# EasyEDA Pro project flight controller.epro

# Schematic Schematic1
Board Name: Board1; Create Date: 2026-03-05; Page Name: P1; Project Name: flight controller; Schematic Name: Schematic1; Update Date: 2026-03-16; Company: EasyEDA.com; Page Size: A4; Version: V1.0
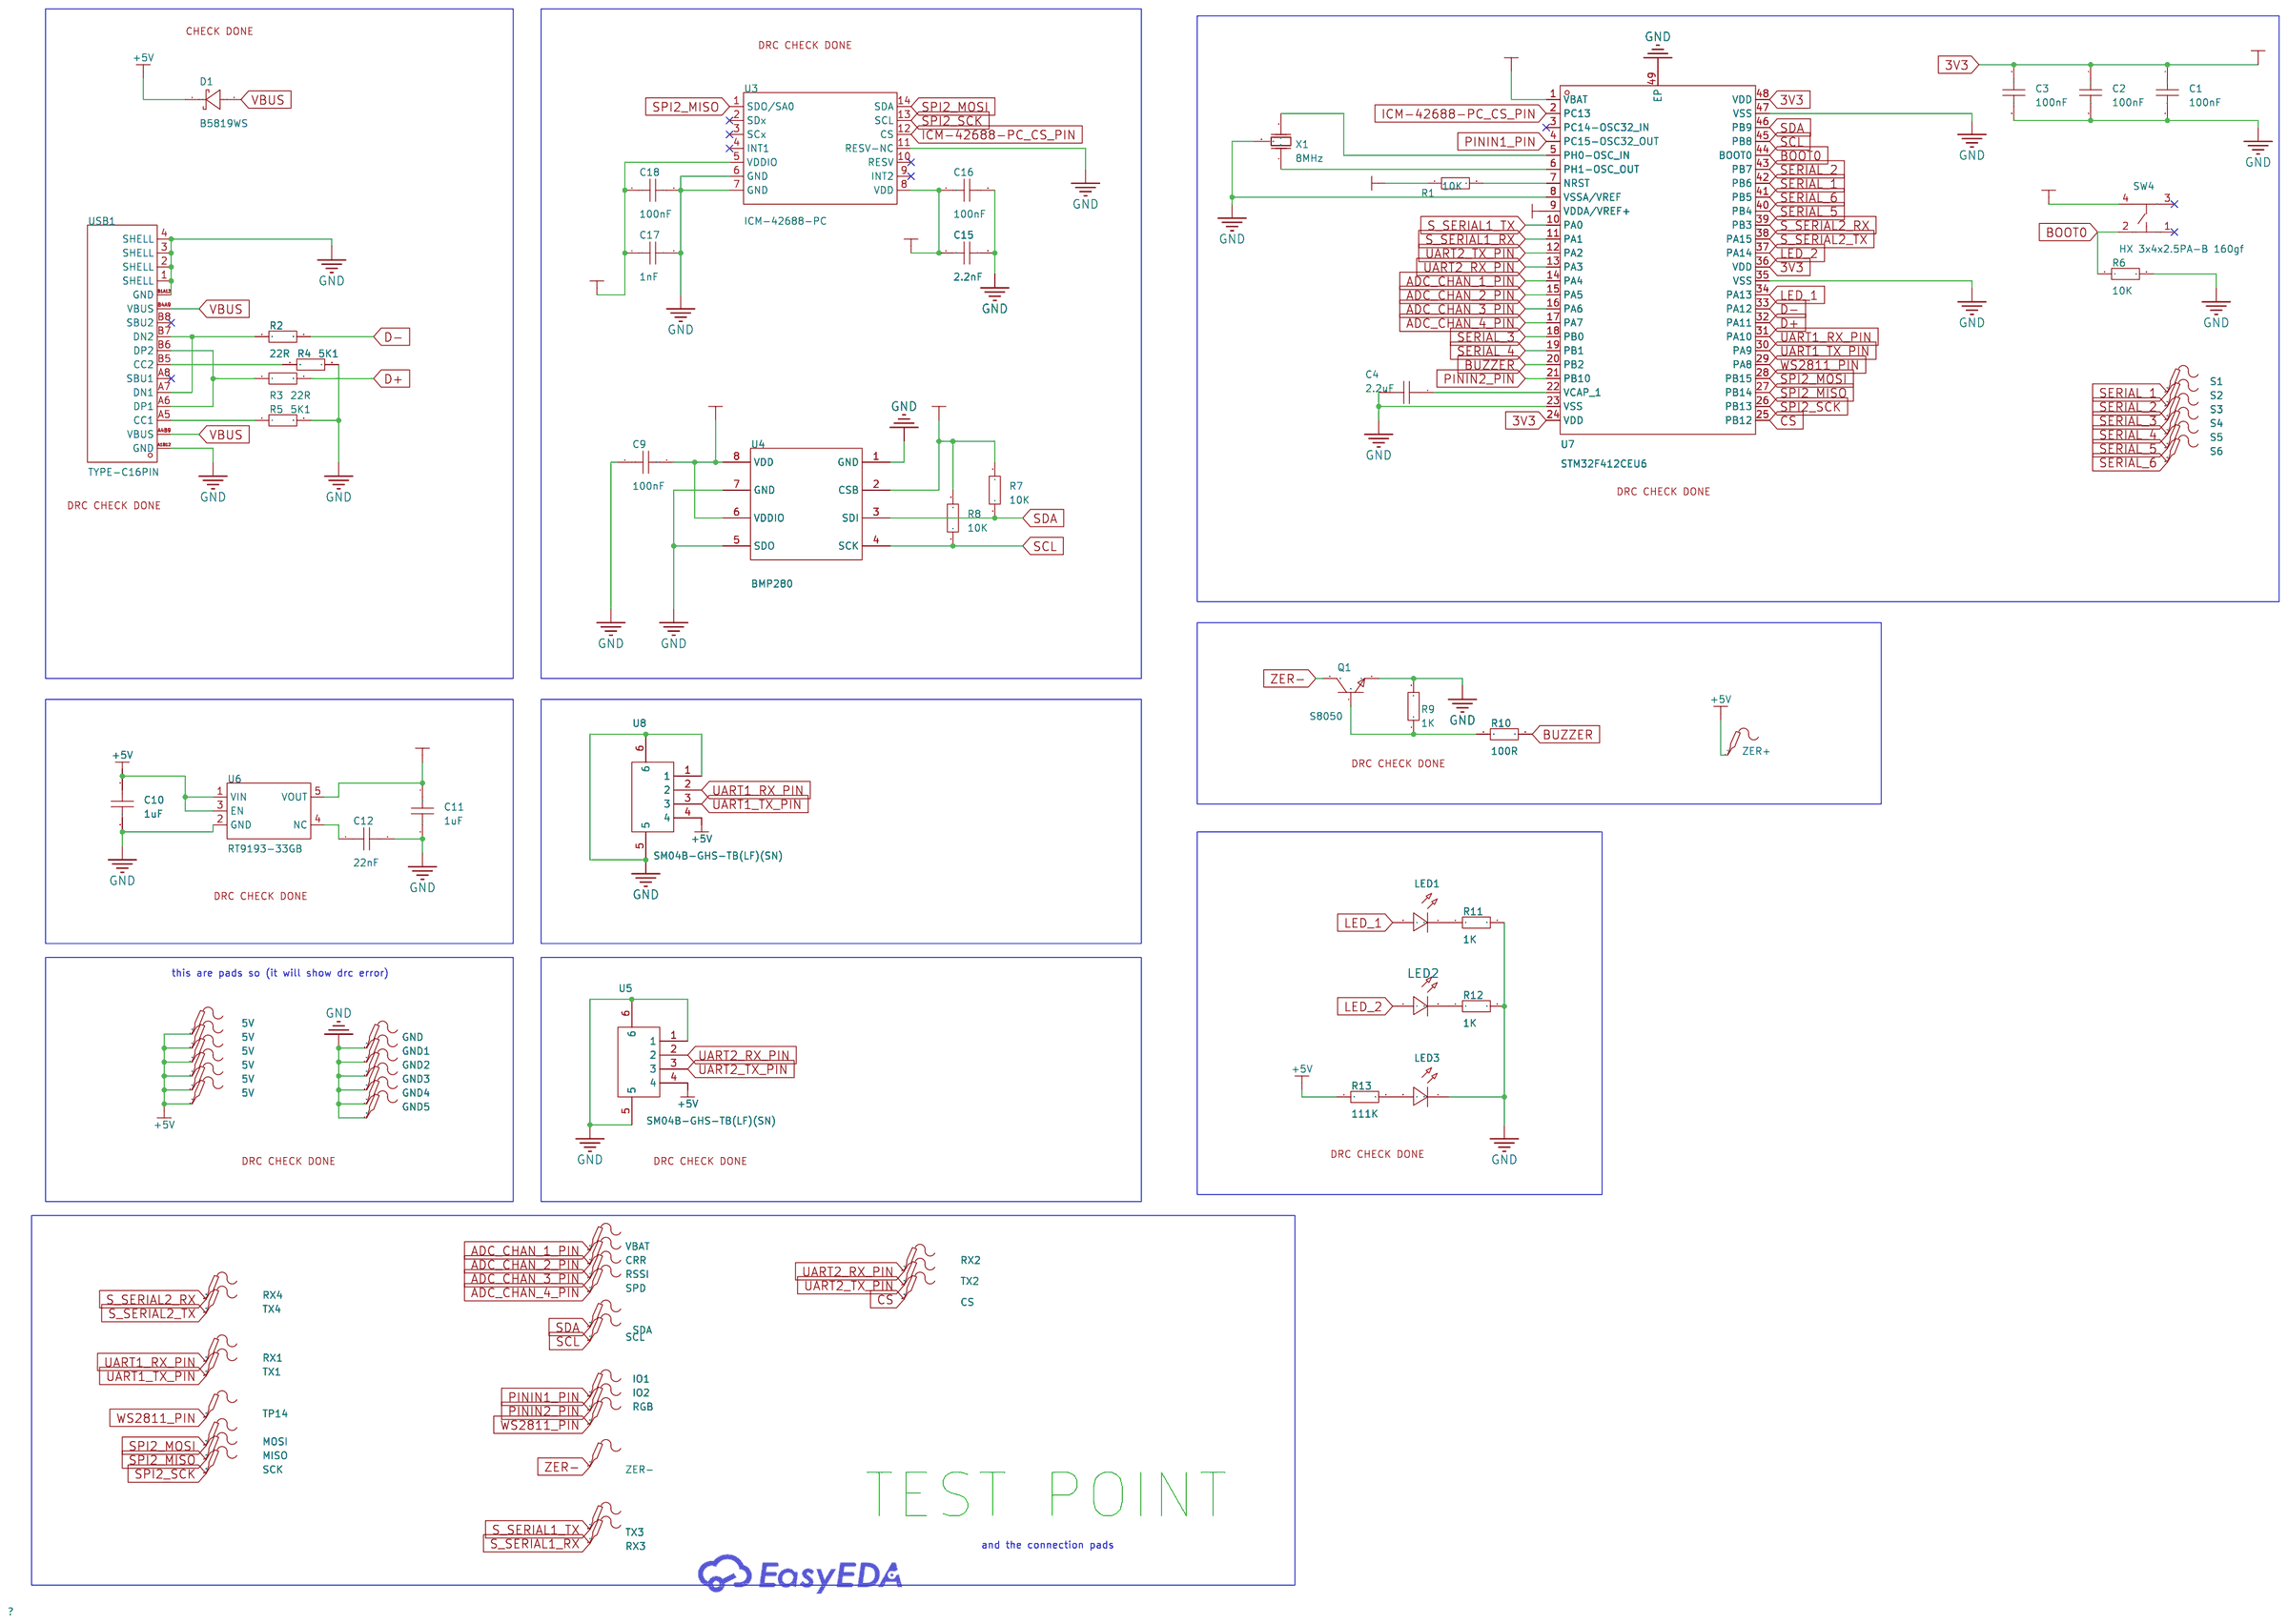
[diagram p0: schematic sheet]

## Parts
5V  -  [Test-Point-0.5mm]
5V#2  -  [Test-Point-0.5mm]
5V#3  -  [Test-Point-0.5mm]
5V#4  -  [Test-Point-0.5mm]
5V#5  -  [Test-Point-0.5mm]
5V#6  -  [Test-Point-0.5mm]
C1  100nF  [C0603]
C2  100nF  [C0603]
C3  100nF  [C0603]
C4  2.2uF  [C0603]
C9  100nF  [C0603]
C10  1uF  [C0603]
C11  1uF  [C0603]
C12  22nF  [C0603]
C15  2.2nF  [C0603]
C16  100nF  [C0603]
C17  1nF  [C0603]
C18  100nF  [C0603]
CRR  -  [Test-Point-0.5mm]
CS  -  [Test-Point-0.5mm]
D1  B5819WS  [SOD-323_L1.7-W1.3-LS2.5-RD]
GND  -  [Test-Point-0.5mm]
GND1  -  [Test-Point-0.5mm]
GND2  -  [Test-Point-0.5mm]
GND3  -  [Test-Point-0.5mm]
GND4  -  [Test-Point-0.5mm]
GND5  -  [Test-Point-0.5mm]
IO1  -  [Test-Point-0.5mm]
IO2  -  [Test-Point-0.5mm]
LED1  -  [LED0603-RD_GREEN]
LED2  -  [LED0603-R-RD]
LED3  -  [LED0603-RD_GREEN]
MISO  -  [Test-Point-0.5mm]
MOSI  -  [Test-Point-0.5mm]
Q1  S8050  [SOT-23-3_L2.9-W1.6-P1.90-LS2.8-BR]
R1  10K  [R0603]
R2  22R  [R0603]
R3  22R  [R0603]
R4  5K1  [R0603]
R5  5K1  [R0603]
R6  10K  [R0603]
R7  10K  [R0603]
R8  10K  [R0603]
R9  1K  [R0603]
R10  100R  [R0603]
R11  1K  [R0603]
R12  1K  [R0603]
R13  111K  [R0603]
RGB  -  [Test-Point-0.5mm]
RSSI  -  [Test-Point-0.5mm]
RX1  -  [Test-Point-0.5mm]
RX2  -  [Test-Point-0.5mm]
RX3  -  [Test-Point-0.5mm]
RX4  -  [Test-Point-0.5mm]
S1  -  [Test-Point-0.5mm]
S2  -  [Test-Point-0.5mm]
S3  -  [Test-Point-0.5mm]
S4  -  [Test-Point-0.5mm]
S5  -  [Test-Point-0.5mm]
S6  -  [Test-Point-0.5mm]
SCK  -  [Test-Point-0.5mm]
SCL  -  [Test-Point-0.5mm]
SDA  -  [Test-Point-0.5mm]
SPD  -  [Test-Point-0.5mm]
SW4  HX 3x4x2.5PA-B 160gf  [SW-SMD_4P-L4.2-W3.4-P2.15-LS5.2]
TP14  -  [Test-Point-0.5mm]
TX1  -  [Test-Point-0.5mm]
TX2  -  [Test-Point-0.5mm]
TX3  -  [Test-Point-0.5mm]
TX4  -  [Test-Point-0.5mm]
U3  ICM-42688-PC  [LGA-14_L3.0-W2.5-P0.50-TL]
U4  BMP280  [LGA-8_L2.5-W2.0-P0.65_AMP6127]
U5  SM04B-GHS-TB(LF)(SN)  [CONN-SMD_4P-P1.25_SM04B-GHS-TB-LF-SN]
U6  RT9193-33GB  [SOT-23-5_L3.0-W1.5-P0.95-LS2.8-BL]
U7  STM32F412CEU6  [UFQFPN-48_L7.0-W7.0-P0.50-BL-EP5.6]
U8  SM04B-GHS-TB(LF)(SN)  [CONN-SMD_4P-P1.25_SM04B-GHS-TB-LF-SN]
USB1  TYPE-C16PIN  [USB-C-SMD_TYPE-C16PIN]
VBAT  -  [Test-Point-0.5mm]
X1  8MHz  [OSC-SMD_3P-L3.2-W1.3-P1.20-L]
ZER+  -  [Test-Point-0.5mm]
ZER-  -  [Test-Point-0.5mm]

## Library data of the parts
5V 5V#2-5V#6 CRR CS GND GND1-GND5 IO1 IO2 MISO MOSI RGB RSSI RX1-RX4 S1-S6 SCK SCL SDA SPD TP14 TX1-TX4 VBAT ZER+ ZER- = Test-Point: Test Point 测试点
C1-C4 C9-C12 C15-C18 = CAP_0603: Supplier Footprint: 0603
D1 = B5819WS_C22368873: Voltage - Forward(Vf@If):900mV@3A Voltage - DC Reverse(Vr):40V Current - Rectified:1A Reverse Leakage Current (Ir):1mA@40V Operating Junction Temperature Range:-55℃~+150℃ Operating Junction Temperature Range:-55℃~+150℃ Non-Repetitive Peak Forward Surge Cu; LCSC Part Name: 电压:40V 电流:1A; Supplier Part: C22368873; Manufacturer: Wild Goose(威谷); Supplier Footprint: SOD-323; JLCPCB Part Class: Extended Part; Datasheet: https://item.szlcsc.com/datasheet/B5819WS/23847185.html; Supplier: LCSC; Voltage - Forward(Vf@If): 900mV@3A; Voltage - DC Reverse(Vr): 40V; Current - Rectified: 1A; Reverse Leakage Current (Ir): 1mA@40V; Operating Junction Temperature Range: -55℃~+150℃; Non-Repetitive Peak Forward Surge Current: 25A
LED1 LED3 = LED_0603-G
LED2 = LED_0603-R: Supplier Footprint: 0603
Q1 = S8050_C7603172: type:NPN Current - Collector(Ic):500mA Collector - Emitter Voltage VCEO:25V Pd - Power Dissipation:300mW DC Current Gain:80@50mA,1V DC Current Gain:80@50mA,1V Transition frequency(fT):- Current - Collector Cutoff:1uA Vce Saturation(VCE(sat)):500mV Operati; LCSC Part Name: NPN 电流:500mA 电压:25V; Supplier Part: C7603172; Manufacturer: KUU; Supplier Footprint: SOT-23; JLCPCB Part Class: Extended Part; Datasheet: https://item.szlcsc.com/datasheet/S8050/8728666.html; Supplier: LCSC; type: NPN; Current - Collector(Ic): 500mA; Collector - Emitter Voltage VCEO: 25V; Pd - Power Dissipation: 300mW; DC Current Gain: 80@50mA,1V; Current - Collector Cutoff: 1uA; Vce Saturation(VCE(sat)): 500mV; Emitter-Base Voltage(Vebo): 5V
R1-R13 = Res_0603: Supplier Footprint: 0603
SW4 = HX 3x4x2.5PA-B 160gf: LCSC Part Name: 3*4*2.5mm 四脚贴片硅胶蓝钮; Supplier Part: C41427503; Manufacturer: hanxia(韩下); Supplier Footprint: SMD-4P,4.2x3.35mm; Datasheet: https://atta.szlcsc.com/upload/public/pdf/source/20241011/97E264A19DD25A542C006A9917ED0D99.pdf; Supplier: LCSC
U3 = ICM-42688-PC: Accelerometer Sensing Axis:X,Y,Z Acceleration Measurement Range (MAX):±16g Acceleration Measurement Range (MAX):±16g Gyroscope Sensing Axis:X,Y,Z Gyroscope Measurement Range (MAX):±2048dps Gyroscope Measurement Range (MAX):±2048dps Sensor Type:IMU Output; LCSC Part Name: 低噪声、宽带宽6D惯性测量单元，带运动协处理器; Supplier Part: C48586483; Manufacturer: Tokmas(托克马斯); Supplier Footprint: LGA-14(2.5x3); JLCPCB Part Class: Extended Part; Datasheet: https://item.szlcsc.com/datasheet/ICM-42688-PC/50854565.html; Supplier: LCSC; Accelerometer Sensing Axis: X,Y,Z; Acceleration Measurement Range (MAX): ±16g; Gyroscope Sensing Axis: X,Y,Z; Gyroscope Measurement Range (MAX): ±2048dps; Sensor Type: IMU; Output Bits: 16bit; Interface: I3C；I2C；SPI; Voltage - Supply: 1.71V~3.6V; Cache Size: 1.5KB; Operating Temperature: -40℃~+85℃
U4 = BMP280: LCSC Part Name: BMP280 停产; Supplier Part: C83291; Manufacturer: Bosch(博世); Supplier Footprint: LGA-8(2x2.5); JLCPCB Part Class: Extended Part; Datasheet: https://atta.szlcsc.com/upload/public/pdf/source/20200702/C83291_F39E84AB7DFC569A4C7554F8659640A1.pdf; Supplier: LCSC
U5 U8 = SM04B-GHS-TB(LF)(SN): Pins Structure:1x4P Pitch:1.25mm Mounting Type:Surface Mount, Right Angle Reference Series:GH Number of Pins:4P Number of Rows:1 Number of PINs Per Row:4 Row Spacing:- Current Rating:1A Contact Material:Phosphor Bronze Contact Plating:Tin Operating Temper; LCSC Part Name: 1x4P 间距:1.25mm 卧贴 系列:GH; Supplier Part: C189895; Manufacturer: JST; Supplier Footprint: SMD,P=1.25mm,卧贴; JLCPCB Part Class: Extended Part; Datasheet: https://item.szlcsc.com/datasheet/SM04B-GHS-TB(LF)(SN)/207060.html; Supplier: LCSC; Pins Structure: 1x4P; Pitch: 1.25mm; Mounting Type: Surface Mount, Right Angle; Reference Series: GH; Number of Pins: 4P; Number of Rows: 1; Number of PINs Per Row: 4; Current Rating: 1A; Contact Material: Phosphor Bronze; Contact Plating: Tin; Operating Temperature: -25℃~+85℃; Voltage Rating: 50V; Plastic Material: PA9T; Flame Retardant Rating: UL94V-0; Supplementary Features: Auxiliary Solder Pin; Color: White; Z-Height of the Board: 4.25mm; X-Length of Bottom Edge on Board (Spacing Line): 8.25mm; Y-Width of Bottom Edge on Board: 4.13mm
U6 = RT9193-33GB_C19268156: Output Type:Fixed Voltage - Supply:6V Output Voltage:3.3V Output Voltage:3.3V Output Current:300mA Power Supply Rejection Ratio (PSRR):70dB@(1KHz) standby current:70uA Noise:50uVrms Features:Enable Operating Temperature:-25℃~+85℃@(Ta) Operating Temperatur; LCSC Part Name: 3.3V 300mA 6V; Supplier Part: C19268156; Manufacturer: TECH PUBLIC(台舟); Supplier Footprint: SOT-23-5; JLCPCB Part Class: Extended Part; Datasheet: https://item.szlcsc.com/datasheet/RT9193-33GB/20526334.html; Supplier: LCSC; Output Type: Fixed; Voltage - Supply: 6V; Output Voltage: 3.3V; Output Current: 300mA; Power Supply Rejection Ratio (PSRR): 70dB@(1KHz); standby current: 70uA; Noise: 50uVrms; Features: Enable; Operating Temperature: -25℃~+85℃@(Ta); Output Configuration: Positive; Number of Outputs: 1
U7 = STM32F412CEU6: CPU Core:ARM-M4 CPU Maximum Speed:100MHz Program Storage Size:512KB Program Memory Type:FLASH Number of I/O:36 ADC (Bit):12bit Voltage - Supply:1.7V~3.6V Voltage - Supply:1.7V~3.6V Applications:-; LCSC Part Name: 支持BAM的STM32动态效率MCU，带DSP和FPU的高性能ARM Cortex-M4 MCU，具有512 KB Flash、100 MHz CPU、ART加速器和DFSDM; Supplier Part: C1337664; Manufacturer: ST(意法半导体); Supplier Footprint: UFQFPN-48(7x7); JLCPCB Part Class: Extended Part; Datasheet: https://item.szlcsc.com/datasheet/STM32F412CEU6/1427944.html; Supplier: LCSC; CPU Core: ARM-M4; CPU Maximum Speed: 100MHz; Program Storage Size: 512KB; Program Memory Type: FLASH; Number of I/O: 36; ADC (Bit): 12bit; Voltage - Supply: 1.7V~3.6V
USB1 = TYPE-C16PIN: Connector Type:Type-C Protocol Standard:- Gender:Female Mounting Type:Surface Mount, Right Angle Number of Contacts:16P Number of Ports:1 Current Rating-Power:3A Voltage Rating:30V Connect-Disconnect Life:10,000 Cycles Supplementary Features:- Center Heig; LCSC Part Name: 16P卧贴母座; Supplier Part: C393939; Manufacturer: SHOU HAN(首韩); Supplier Footprint: SMD; JLCPCB Part Class: Extended Part; Datasheet: https://item.szlcsc.com/datasheet/TYPE-C16PIN/372551.html; Supplier: LCSC; Connector Type: Type-C; Gender: Female; Mounting Type: Surface Mount, Right Angle; Number of Contacts: 16P; Number of Ports: 1; Current Rating-Power: 3A; Voltage Rating: 30V; Connect-Disconnect Life: 10,000 Cycles; Detection color: Black; Operating Temperature: -40℃~+85℃
X1 = CSTNE8M00GH5C000R0: Frequency:8MHz Built - in Load Capacitance:33pF Resonant Impedance:40Ω Operating Temperature:-40℃~+125℃ Operating Temperature:-40℃~+125℃; LCSC Part Name: 8MHz ±0.07% 内置负载电容:33pF; Supplier Part: C341525; Manufacturer: muRata(村田); Supplier Footprint: SMD3213-3P; JLCPCB Part Class: Extended Part; Datasheet: https://item.szlcsc.com/datasheet/CSTNE8M00GH5C000R0/318917.html; Supplier: LCSC; Built - in Load Capacitance: 33pF; Resonant Impedance: 40Ω; Operating Temperature: -40℃~+125℃

## Nets
3V3: C1.1 C2.1 C3.1 C9.1 C11.1 C15.1 C16.1 C17.1 C18.1 R1.1 R7.2 R8.2 SW4.4 U3.5(VDDIO) U3.8(VDD) U4.2(CSB) U4.6(VDDIO) U4.8(VDD) U6.5(VOUT) U7.1(VBAT) U7.9(VDDA/VREF+) U7.24(VDD) U7.36(VDD) U7.48(VDD)
+5V: 5V.1 5V#2.1 5V#3.1 5V#4.1 5V#5.1 5V#6.1 C10.1 D1.1(C) R13.1 U5.4 U6.1(VIN) U6.3(EN) U8.4 ZER+.1
GND: C1.2 C2.2 C3.2 C4.2 C9.2 C10.2 C11.2 C12.2 C15.2 C16.2 C17.2 C18.2 GND.1 GND1.1 GND2.1 GND3.1 GND4.1 GND5.1 LED3.1(C) Q1.2(E) R4.2 R5.2 R6.2 R9.2 R11.2 R12.2 U3.6(GND) U3.7(GND) U3.11(RESV-NC) U4.1(GND) U4.5(SDO) U4.7(GND) U5.1 U5.5 U5.6 U6.2(GND) U7.8(VSSA/VREF) U7.23(VSS) U7.35(VSS) U7.47(VSS) U7.49(EP) U8.1 U8.5 U8.6 USB1.1(SHELL) USB1.2(SHELL) USB1.3(SHELL) USB1.4(SHELL) USB1.A1B12(GND) USB1.B1A12(GND) X1.2(GND)
VBUS: D1.2(A) USB1.A4B9(VBUS) USB1.B4A9(VBUS)
ADC_CHAN_1_PIN: U7.14(PA4) VBAT.1
ADC_CHAN_2_PIN: CRR.1 U7.15(PA5)
ADC_CHAN_3_PIN: RSSI.1 U7.16(PA6)
ADC_CHAN_4_PIN: SPD.1 U7.17(PA7)
BOOT0: R6.1 SW4.2 U7.44(BOOT0)
BUZZER: R10.2 U7.20(PB2)
CS: CS.1 U7.25(PB12)
D+: R3.2 U7.32(PA11)
D-: R2.2 U7.33(PA12)
ICM-42688-PC_CS_PIN: U3.12(CS) U7.2(PC13)
LED_1: LED1.2(A) U7.34(PA13)
LED_2: LED2.1(A) U7.37(PA14)
PININ1_PIN: IO1.1 U7.4(PC15-OSC32_OUT)
PININ2_PIN: IO2.1 U7.21(PB10)
S_SERIAL1_RX: RX3.1 U7.11(PA1)
S_SERIAL1_TX: TX3.1 U7.10(PA0)
S_SERIAL2_RX: RX4.1 U7.39(PB3)
S_SERIAL2_TX: TX4.1 U7.38(PA15)
SCL: R8.1 SCL.1 U4.4(SCK) U7.45(PB8)
SDA: R7.1 SDA.1 U4.3(SDI) U7.46(PB9)
SERIAL_1: S1.1 U7.42(PB6)
SERIAL_2: S2.1 U7.43(PB7)
SERIAL_3: S3.1 U7.18(PB0)
SERIAL_4: S4.1 U7.19(PB1)
SERIAL_5: S5.1 U7.40(PB4)
SERIAL_6: S6.1 U7.41(PB5)
SPI2_MISO: MISO.1 U3.1(SDO/SA0) U7.27(PB14)
SPI2_MOSI: MOSI.1 U3.14(SDA) U7.28(PB15)
SPI2_SCK: SCK.1 U3.13(SCL) U7.26(PB13)
UART1_RX_PIN: RX1.1 U7.31(PA10) U8.2
UART1_TX_PIN: TX1.1 U7.30(PA9) U8.3
UART2_RX_PIN: RX2.1 U5.2 U7.13(PA3)
UART2_TX_PIN: TX2.1 U5.3 U7.12(PA2)
WS2811_PIN: RGB.1 TP14.1 U7.29(PA8)
ZER-: Q1.3(C) ZER-.1
$1N2914: C4.1 U7.22(VCAP_1)
$1N3163: U7.6(PH1-OSC_OUT) X1.1(OSC1)
$1N3172: U7.5(PH0-OSC_IN) X1.3(OSC2)
$1N3229: R1.2 U7.7(NRST)
$1N5682: R2.1 USB1.A7(DN1) USB1.B7(DN2)
$1N5704: R3.1 USB1.A6(DP1) USB1.B6(DP2)
$1N5719: R4.1 USB1.B5(CC2)
$1N5723: R5.1 USB1.A5(CC1)
$1N8041: C12.1 U6.4(NC)
$1N9067: Q1.1(B) R9.1 R10.1
$1N10019: LED2.2(C) R12.1
$1N15873: LED3.2(A) R13.2
$1N16015: LED1.1(C) R11.1

Not connected (* = marked no-connect by the designer): SW4 1* 3*; U3 2(SDx)* 3(SCx)* 4(INT1)* 9(INT2)* 10(RESV)*; U7 3(PC14-OSC32_IN)*; USB1 A8(SBU1)* B8(SBU2)*

## Notes on the sheet
- CHECK DONE
- DRC CHECK DONE
- DRC CHECK DONE
- DRC CHECK DONE
- DRC CHECK DONE
- DRC CHECK DONE
- this are pads so (it will show drc error)
- DRC CHECK DONE
- DRC CHECK DONE
- DRC CHECK DONE
- TEST POINT
- and the connection pads

# Board PCB1
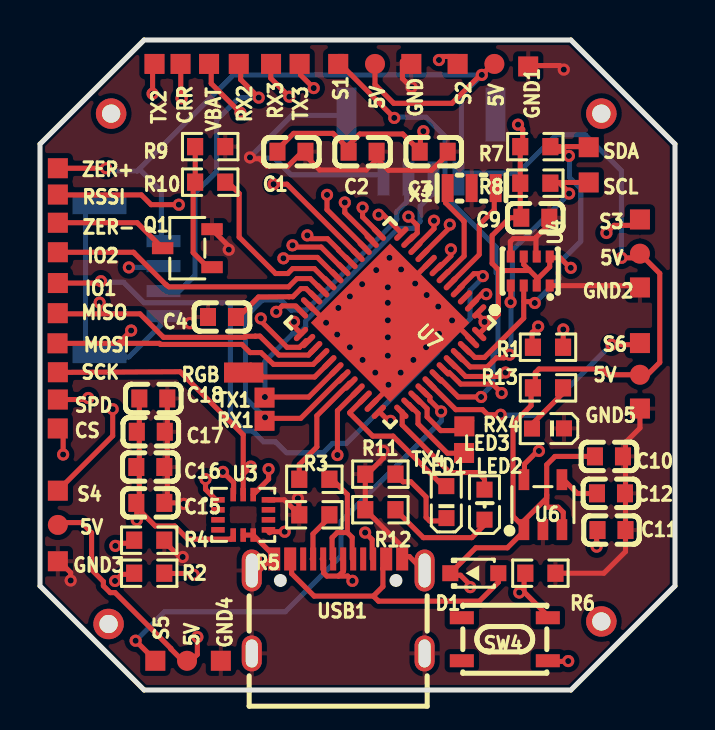
[diagram p1: board, top side]
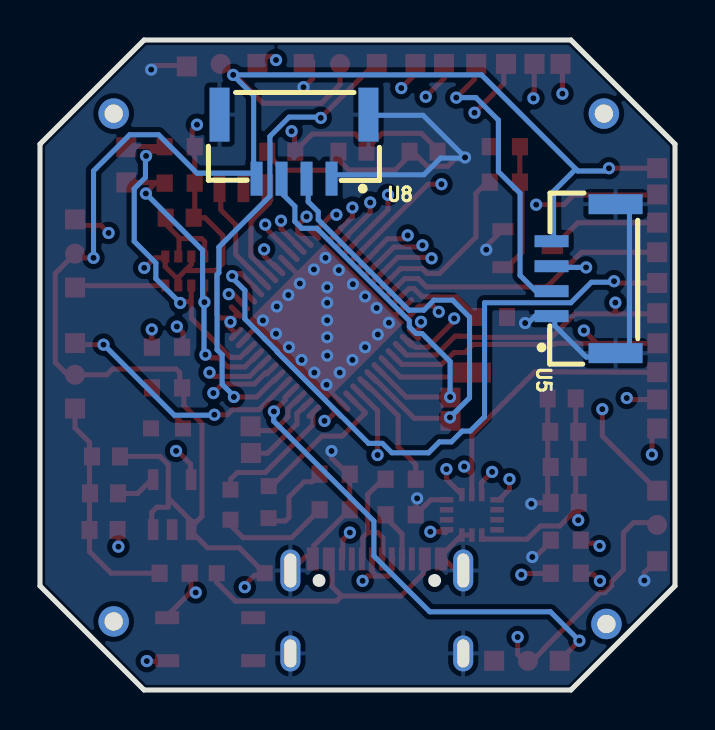
[diagram p2: board, bottom side, seen from below]

Outline 31.75 x 32.51 mm; copper layers: Top Layer, pads, power, Inner3, Inner4, Inner5, Inner6, Inner7, Inner8, Inner9, Inner10, Inner11, Inner12, Inner13, Inner14, Inner15, Inner16, Inner17, Inner18, Inner19, Inner20, Inner21, Inner22, Inner23, Inner24, Inner25, Inner26, Inner27, Inner28, Inner29, Inner30, Bottom Layer. Coordinates in mm from the lower left corner of the outline.
Outline path: 0,27.3 0,5.21 5.21,0 26.54,0 31.75,5.21 31.75,27.3 26.54,32.51 5.21,32.51 0,27.3
Stack: Top Layer 0.035mm Outer layer thickness 1oz / Dielectric1 0.2104mm 7628 RC49% 8.6mil / pads 0.0152mm Inner layer thickness / Dielectric2 1.065mm 1.1mm H/HOZ Copper / power 0.0152mm Inner layer thickness / Dielectric3 0.2104mm 7628 RC49% 8.6mil / Bottom Layer 0.035mm Outer layer thickness 1oz

## Design rules (mm)
template: JLCPCB Capability(Two Layers Board)
spacing copperThickness1oz (default): track to track 0.102, other pairs 0.152 to 0.3
spacing copperThickness2oz: track to track 0.203, other pairs 0.152 to 0.3
track width copperThickness1oz (default): min 0.127, default 0.254, max 2.54
track width copperThickness2oz: min 0.203, default 0.254, max 2.54
differential pair differentialPair (default): width min 0.127, default 0.254, max 2.54; gap min 0.152, default 0.152
via viaSize (default): diameter min 0.5, default 0.61, max 10; hole min 0.3, default 0.305, max 6.3

## Placement (name value [footprint] x y rotation side)
5V  -  [Test-Point-0.5mm#2]  30 15.77 270 top
5V#2  -  [Test-Point-0.5mm#2]  22.72 31.31 180 top
5V#3  -  [Test-Point-0.5mm#2]  30 21.82 270 top
5V#4  -  [Test-Point-0.5mm#2]  0.89 8.26 270 top
5V#5  -  [Test-Point-0.5mm#2]  7.35 1.46 0 top
5V#6  -  [Test-Point-0.5mm#2]  16.75 31.31 0 top
C1  100nF  [C0603]  12.57 26.92 0 top
C2  100nF  [C0603]  16.13 26.92 0 top
C3  100nF  [C0603]  19.69 26.92 0 top
C4  2.2uF  [C0603]  9.1 18.66 180 top
C9  100nF  [C0603]  24.77 23.62 0 top
C10  1uF  [C0603]  28.45 11.68 0 top
C11  1uF  [C0603]  28.58 8 0 top
C12  22nF  [C0603]  28.55 9.84 0 top
C15  2.2nF  [C0603]  5.52 9.36 0 top
C16  100nF  [C0603]  5.52 11.15 0 top
C17  1nF  [C0603]  5.54 12.92 0 top
C18  100nF  [C0603]  5.67 14.58 0 top
CRR  -  [Test-Point-0.5mm]  7.03 31.31 0 top
CS  -  [Test-Point-0.5mm]  0.89 13.08 0 top
D1  B5819WS  [SOD-323_L1.7-W1.3-LS2.5-RD]  21.72 5.84 0 top
GND  -  [Test-Point-0.5mm]  18.57 31.31 0 top
GND1  -  [Test-Point-0.5mm]  24.41 31.19 0 top
GND2  -  [Test-Point-0.5mm]  30 20.13 270 top
GND3  -  [Test-Point-0.5mm]  0.89 6.44 270 top
GND4  -  [Test-Point-0.5mm]  9.04 1.46 0 top
GND5  -  [Test-Point-0.5mm]  30 14.08 270 top
IO1  -  [Test-Point-0.5mm]  0.89 20.35 0 top
IO2  -  [Test-Point-0.5mm]  0.89 21.89 0 top
LED1  -  [LED0603-RD_GREEN]  20.32 9.4 90 top
LED2  -  [LED0603-R-RD]  22.23 9.27 90 top
LED3  -  [LED0603-RD_GREEN]  25.4 13.08 180 top
MISO  -  [Test-Point-0.5mm]  0.89 18.85 0 top
MOSI  -  [Test-Point-0.5mm]  0.88 17.34 0 top
NOREF  -  [Pad_e175]  28.07 28.83 0 top
NOREF#2  -  [Pad_e178]  3.43 3.3 0 top
NOREF#3  -  [Pad_e177]  28.07 3.43 0 top
NOREF#4  -  [Pad_e173]  3.56 28.83 0 top
Q1  S8050  [SOT-23-3_L2.9-W1.6-P1.90-LS2.8-BR]  7.37 22.1 0 top
R1  10K  [R0603]  25.4 17.14 180 top
R2  22R  [R0603]  5.46 5.84 0 top
R3  22R  [R0603]  13.72 10.54 180 top
R4  5K1  [R0603]  5.46 7.49 0 top
R5  5K1  [R0603]  13.72 8.76 180 top
R6  10K  [R0603]  25.02 5.84 0 top
R7  10K  [R0603]  24.77 27.18 180 top
R8  10K  [R0603]  24.77 25.35 180 top
R9  1K  [R0603]  8.51 27.18 0 top
R10  100R  [R0603]  8.51 25.4 0 top
R11  1K  [R0603]  17.02 10.79 180 top
R12  1K  [R0603]  17.02 9.02 180 top
R13  111K  [R0603]  25.4 15.11 0 top
RGB  -  [Test-Point-0.5mm]  10.67 15.88 0 top
RSSI  -  [Test-Point-0.5mm]  0.89 24.78 0 top
RX1  -  [Test-Point-0.5mm]  11.23 13.46 0 top
RX2  -  [Test-Point-0.5mm]  9.94 31.31 0 top
RX3  -  [Test-Point-0.5mm]  11.55 31.31 0 top
RX4  -  [Test-Point-0.5mm]  21.22 13.19 0 top
S1  -  [Test-Point-0.5mm]  14.91 31.31 0 top
S2  -  [Test-Point-0.5mm]  20.88 31.31 180 top
S3  -  [Test-Point-0.5mm]  30 23.54 270 top
S4  -  [Test-Point-0.5mm]  0.89 9.97 270 top
S5  -  [Test-Point-0.5mm]  5.77 1.46 0 top
S6  -  [Test-Point-0.5mm]  30 17.35 270 top
SCK  -  [Test-Point-0.5mm]  0.89 15.89 0 top
SCL  -  [Test-Point-0.5mm]  27.44 25.39 0 top
SDA  -  [Test-Point-0.5mm]  27.44 27.15 0 top
SPD  -  [Test-Point-0.5mm]  0.89 14.53 0 top
SW4  HX 3x4x2.5PA-B 160gf  [SW-SMD_4P-L4.2-W3.4-P2.15-LS5.2]  23.24 2.54 0 top
TP14  -  [Test-Point-0.5mm]  9.7 15.88 0 top
TX1  -  [Test-Point-0.5mm]  11.23 14.62 0 top
TX2  -  [Test-Point-0.5mm]  5.73 31.31 0 top
TX3  -  [Test-Point-0.5mm]  12.98 31.31 0 top
TX4  -  [Test-Point-0.5mm]  21.2 11.86 0 top
U3  ICM-42688-PC  [LGA-14_L3.0-W2.5-P0.50-TL]  10.16 8.76 0 top
U4  BMP280  [LGA-8_L2.5-W2.0-P0.65_AMP6127]  24.51 20.95 270 top
U5  SM04B-GHS-TB(LF)(SN)  [CONN-SMD_4P-P1.25_SM04B-GHS-TB-LF-SN]  4.57 20.57 90 bottom
U6  RT9193-33GB  [SOT-23-5_L3.0-W1.5-P0.95-LS2.8-BL]  25.15 9.27 0 top
U7  STM32F412CEU6  [UFQFPN-48_L7.0-W7.0-P0.50-BL-EP5.6]  17.5 18.37 135 top
U8  SM04B-GHS-TB(LF)(SN)  [CONN-SMD_4P-P1.25_SM04B-GHS-TB-LF-SN]  19.05 27.18 0 bottom
USB1  TYPE-C16PIN  [USB-C-SMD_TYPE-C16PIN]  14.91 4.19 0 top
VBAT  -  [Test-Point-0.5mm]  8.45 31.31 0 top
X1  8MHz  [OSC-SMD_3P-L3.2-W1.3-P1.20-L]  21.58 25.1 0 top
ZER+  -  [Test-Point-0.5mm]  0.89 26.1 0 top
ZER-  -  [Test-Point-0.5mm]  0.89 23.37 0 top

## Footprints (pads in the part's own frame, mm; a bottom-side part is the same pattern mirrored in y, then rotated)
C0603
  rect 0.8x0.9 smd: 1(-0.7,0) 2(0.7,0)
CONN-SMD_4P-P1.25_SM04B-GHS-TB-LF-SN
  rect 0.6x1.7 smd: 1(-1.875,1.599) 2(-0.625,1.599) 3(0.625,1.599) 4(1.875,1.599)
  rect 1x2.7 smd: 5(3.724,-1.599) 6(-3.724,-1.599)
LED0603-R-RD
  rect 0.8x0.8 smd: 1(0.751,0) 2(-0.751,0)
LED0603-RD_GREEN
  rect 0.8x0.8 smd: 1(-0.799,-0.004) 2(0.799,0.004)
LGA-8_L2.5-W2.0-P0.65_AMP6127
  rect 0.6x0.4 smd: 1(0.725,0.975) 2(0.725,0.325) 3(0.725,-0.325) 4(0.725,-0.975) 5(-0.725,-0.975) 6(-0.725,-0.325) 7(-0.725,0.325) 8(-0.725,0.975)
LGA-14_L3.0-W2.5-P0.50-TL
  rect 0.675x0.28 smd: 1(-1.262,0.75) 2(-1.262,0.25) 3(-1.262,-0.25) 4(-1.262,-0.75) 8(1.262,-0.75) 9(1.262,-0.25) 10(1.262,0.25) 11(1.262,0.75)
  rect 0.28x0.675 smd: 5(-0.5,-1.012) 6(0,-1.012) 7(0.5,-1.012) 12(0.5,1.012) 13(0,1.012) 14(-0.5,1.012)
OSC-SMD_3P-L3.2-W1.3-P1.20-L
  rect 0.6x1.4 smd: 1(-1.199,0) 2(0,0) 3(1.199,0)
Pad_e173
  round 1.524 hole 0.914: 1(0,0)
Pad_e175
  round 1.524 hole 0.914: 2(0,0)
Pad_e177
  round 1.524 hole 0.914: 3(0,0)
Pad_e178
  round 1.524 hole 0.914: 4(0,0)
R0603
  rect 0.806x0.864 smd: 1(-0.753,0) 2(0.753,0)
SOD-323_L1.7-W1.3-LS2.5-RD
  rect 0.8x0.8 smd: 1(-1.2,0) 2(1.2,0)
SOT-23-3_L2.9-W1.6-P1.90-LS2.8-BR
  rect 1.07x0.6 smd: 1(1.235,-0.95) 2(1.235,0.95) 3(-1.235,0)
SOT-23-5_L3.0-W1.5-P0.95-LS2.8-BL
  rect 0.532x1.045 smd: 1(-0.95,-1.25) 2(0,-1.25) 3(0.95,-1.25) 4(0.95,1.25) 5(-0.95,1.25)
SW-SMD_4P-L4.2-W3.4-P2.15-LS5.2
  rect 1.2x0.65 smd: 1(-2.15,1.075) 2(2.15,1.075) 3(-2.15,-1.075) 4(2.15,-1.075)
Test-Point-0.5mm
  rect 1x1 smd: 1(0,0)
Test-Point-0.5mm#2
  round 1 smd: 1(0,0)
UFQFPN-48_L7.0-W7.0-P0.50-BL-EP5.6
  oval 0.28x0.9 smd: 1(-2.751,-3.547) 2(-2.251,-3.547) 3(-1.75,-3.547) 4(-1.25,-3.547) 5(-0.75,-3.547) 6(-0.249,-3.547) 7(0.249,-3.547) 8(0.75,-3.547) 9(1.25,-3.547) 10(1.75,-3.547) 11(2.251,-3.547) 12(2.751,-3.547) 25(2.751,3.547) 26(2.251,3.547) 27(1.75,3.547) 28(1.25,3.547) 29(0.75,3.547) 30(0.249,3.547) 31(-0.249,3.547) 32(-0.75,3.547) 33(-1.25,3.547) 34(-1.75,3.547) 35(-2.251,3.547) 36(-2.751,3.547)
  oval 0.9x0.28 smd: 13(3.547,-2.75) 14(3.547,-2.25) 15(3.547,-1.75) 16(3.547,-1.25) 17(3.547,-0.75) 18(3.547,-0.25) 19(3.547,0.25) 20(3.547,0.75) 21(3.547,1.25) 22(3.547,1.75) 23(3.547,2.25) 24(3.547,2.75) 37(-3.547,2.751) 38(-3.547,2.251) 39(-3.547,1.75) 40(-3.547,1.25) 41(-3.547,0.75) 42(-3.547,0.249) 43(-3.547,-0.249) 44(-3.547,-0.75) 45(-3.547,-1.25) 46(-3.547,-1.75) 47(-3.547,-2.251) 48(-3.547,-2.751)
  rect 5.6x5.6 smd: 49(0,0)
USB-C-SMD_TYPE-C16PIN
  oval 1x2.1 hole 0.6x1.7: 1(-4.32,1.788) 2(4.32,1.788)
  oval 1x1.8 hole 0.6x1.4: 3(-4.32,-2.362) 4(4.32,-2.362)
  rect 0.6x1.15 smd: A1B12(-3.2,2.362) A4B9(-2.4,2.362) B1A12(3.2,2.362) B4A9(2.4,2.362)
  rect 0.3x1.15 smd: A5(-1.25,2.362) A6(-0.25,2.362) A7(0.25,2.362) A8(1.25,2.362) B5(1.75,2.362) B6(0.75,2.362) B7(-0.75,2.362) B8(-1.75,2.362)

## Nets
As in the schematic.

Pads without a net: NOREF 2; NOREF#2 4; NOREF#3 3; NOREF#4 1; SW4 1 3; U3 2 3 4 9 10; U7 3; USB1 A8 B8

## Via types
v1: diameter 0.61, hole 0.305, Top Layer to Bottom Layer, 111 vias

## Routing (per net, layer and track width the routed paths; a pad name or vN(x,y) marks a point on that pad's centre or on a via; arc(x,y) is an arc through that point)
3V3: length 111.7
  Top Layer w0.254: 24.45,21.02 24.84,20.63 24.84,20.52 ; 24.45,21.02 24.43,21.02 ; 24.45,21.02 24.41,20.98 22.99,20.98 22.97,20.97 ; 24.45,21.02 24.19,21.28 U4.6 ; v1(26.16,18.03) 26.16,17.15 R1.1 ; 4.84,9.49 v1(4.84,8.5) ; 11.37,7.98 11.48,7.87 11.53,7.92 v1(12.23,7.92) ; 25.32,1.43 26.39,1.43 v1(26.41,1.45) ; 27.88,7.98 27.83,7.93 v1(27.83,7.17) ; 25.49,21.62 26,21.62 26.51,21.12 ; 25.49,21.62 25.49,21.17 24.84,20.52 ; 25.49,21.62 25.42,21.62 ; 9.62,7.63 9.53,7.55 7.39,7.55 6.73,8.2 5.76,8.2 4.88,9.08 ; 19.02,26.93 18.14,27.81 15.99,27.81 15.39,27.21 ; 24.84,20.52 U4.2 ; 11.79,27.03 11.87,27.03 12.68,27.84 14.65,27.84 15.44,27.05 ; v1(23.9,28.28) 24.14,28.04 24.14,27.23 ; R7.2 R8.2 24.01,23.68 C9.1 23.5,23.62 22.61,22.73 22.61,21.34 22.92,21.02 22.92,18.79 22.74,18.61 22.37,18.61 ; 21.92,18.78 21.92,18.76 22.29,18.39 ; 21.96,17.82 22.39,18.25 ; 24.22,10.36 24.22,11.3 24.89,11.97 ; 19.06,21.71 20.49,23.13 v1(20.49,23.28) ; 19.08,27.95 19.02,27.89 19.02,26.86 ; 4.97,9.51 C18.1 ; 12.79,19.21 12.11,19.21 v1(11.81,18.92) ; 16.96,13.93 17.42,13.46 v1(17.53,13.46)
  power w0.254: 4.83,8.47 11.67,8.47 v1(12.23,7.92) 12.31,7.92 17.5,13.11 17.5,13.4 ; 27.77,7.1 24.95,9.92 24.95,11.8 24.92,16.12 26.27,17.48 26.27,17.96 ; 13.03,17.81 12.49,17.81 12.47,17.83 12.46,17.83 11.8,18.49 11.8,18.96 ; 17.55,13.5 17.55,13.72 22.19,18.36 ; v1(20.49,23.28) 20.49,26.63 v1(19.17,27.95) ; 23.96,28.25 19.41,28.25 19.12,27.97 ; 26.27,18.05 26.54,18.31 v1(26.54,21.12) ; 26.27,18.05 26.27,18.07 ; 26.27,18.05 26.18,17.96 ; 13.05,17.83 17.41,13.47 ; 26.41,1.52 26.41,5.69 27.87,7.15
  vias: v1(22.23,18.41) v1(24.95,11.96)
+5V: length 118.1
  Top Layer w0.254: 24.55,15.28 24.55,14.22 23.65,13.32 23.65,8.69 24.02,8.33 ; 24.2,8.45 U6.1 24.2,7.94 23.37,7.11 21.79,7.11 D1.1 ; 25.34,9.16 25.34,9.77 ; 25.34,9.77 25.33,9.6 24.05,8.32 ; 25.34,9.77 25.34,11.27 25.74,11.67 ; 25.74,11.68 C10.1 ; U6.3 26.16,8.09 26.16,8.89 25.91,9.14 25.34,9.14 ; v1(29.07,21.61) 29.65,21.61 29.9,21.87 ; R13.1 24.77,15.23 24.77,15.88 24.94,16.05 28.12,16.05 28.4,15.77 5V.1 30.37,15.77 30.99,16.38 30.99,20.83 5V#3.1 ; 21.97,30.72 20.6,29.35 17.69,29.35 16.75,30.28 16.75,31.3 ; 22.83,31.31 22.64,31.31 v1(22.09,30.77) ; 7.23,1.37 6.55,2.05 6.55,2.08 3.75,4.87 3.51,4.87 3.17,5.21 3.17,5.43 2.58,6.02 2.58,7.87 2.08,8.37 0.93,8.37 ; 21.59,5.18 21.02,5.74 20.64,5.74 ; ZER+.1 v1(3.3,26.1) ; v1(7.87,2.65) 7.87,1.78 7.37,1.28
  power w0.254: v1(21.51,5.15) 19.37,3.01 10.27,3.01 9.89,2.63 7.87,2.63
  Bottom Layer w0.254: 3.26,26.06 3.18,26.15 ; 21.07,25.85 23.9,25.85 25.82,27.77 27.27,27.77 29.07,25.96 v1(29.07,21.61) ; 21.07,25.85 21.07,29.73 22.12,30.78 ; 21.07,25.85 20.86,25.85 ; 3.29,25.96 4.87,25.96 4.96,26.06 ; 6.07,22.45 6.07,24.95 4.96,26.06 ; 4.96,26.06 9.67,30.77 21.93,30.77 22,30.84
GND: length 98.9
  Top Layer w0.254: R11.2 R12.2 18.06,7.22 18.06,6.55 ; R6.2 28.19,5.84 29.28,6.92 C11.2 29.28,11.56 C10.2 29.28,11.81 29.28,12.38 30,13.11 GND5.1 ; 6.22,7.42 6.98,6.65 v1(7.14,6.65) ; v1(9.44,22.02) 9.44,22.19 8.52,23.11 ; 16.35,10.79 17.17,11.61 v1(17.17,11.95) ; v1(7.19,9.31) 7.14,9.36 6.31,9.36 ; 19.5,21.42 17.52,19.44 17.52,15.2 16.6,14.28 ; 11.58,6.59 10.8,5.81 10.58,5.81 ; 12.93,9.57 12.94,9.56 12.94,8.97 ; 11.66,6.75 U3.7 U3.6 ; 10.45,26.57 10.98,26.57 11.36,26.19 12.39,26.19 13.16,26.96 13.22,26.96 ; 25.46,23.29 24.74,22.58 23.67,22.58 23.52,22.43 23.52,21.77 ; 18.17,6.67 18.47,6.67 19.24,5.91 ; 18.71,31.44 18.12,31.44 18.12,30.59 18.57,30.14 ; U3.11 12.21,9.51 12.85,8.88 ; 20.45,26.87 19.58,25.99 17.43,25.99 16.93,26.49 ; 25.46,20.22 29.8,20.22 29.98,20.04 ; v1(26.19,31.03) 25.98,31.24 24.56,31.24 ; v1(20.6,18.49) 21.62,17.47 21.62,17.47 ; 0.95,6.45 1.53,5.87 v1(1.53,5.48) ; 11.66,6.55 11.66,6.59 ; C18.2 6.37,9.51 ; 13.42,19.3 14.3,18.42 v1(14.3,18.37) ; 13.25,26.74 13.99,26.01 16.31,26.01 16.94,26.64 ; 24.8,21.67 24.8,22.63 ; C15.2 6.26,9.41
  pads w0.254: 17.38,15.21 16.43,14.26 16.43,12.69 17.14,11.98 17.29,11.98
  Bottom Layer w0.254: 10.53,26.61 11.72,26.61 12.55,25.77 16.92,25.77 ; 6.22,18.7 7,18.7 7.32,18.37 ; 2.28,24.36 2.28,16.9 2.12,16.75 ; 10.57,26.72 12.59,28.74 15.5,28.74 ; 6.01,18.52 6.01,18.23 4.44,16.66 3.81,16.66 3.68,16.78 3.47,16.78
  vias: v1(7.49,18.35) v1(10.5,26.64) v1(12.9,9.59) v1(14.86,17.78) v1(14.92,19.11) v1(15.49,19.68) v1(15.49,17.14) v1(16.11,20.3) v1(16.13,16.51) v1(16.81,21) v1(16.76,15.88) v1(17.39,20.14) v1(17.39,19.37) v1(17.39,18.49) v1(17.39,17.64) v1(17.39,16.72) v1(17.47,21.61) v1(17.42,15.27) v1(18.06,21.03) v1(18.03,15.88) v1(18.58,30.15) v1(18.67,16.51) v1(18.76,20.33) v1(19.3,17.14) v1(19.34,19.75) v1(19.91,19.18) v1(19.95,17.82)
VBUS: length 14.6
  Top Layer w0.254: 12.46,6.55 12.58,6.43 12.58,5.82 13.71,4.7 16.67,4.7 ; 16.67,4.7 17.15,5.17 17.15,6.08 17.26,6.19 17.26,6.55 ; 16.67,4.7 16.92,4.44 21.97,4.44 22.92,5.39 D1.2
ADC_CHAN_1_PIN: length 12.5
  Top Layer w0.254: 16.6,22.48 16.6,22.52 15.24,23.88 v1(15.24,24.38) ; 8.56,31.05 8.56,30.34 v1(10.02,28.87)
  power w0.254: 9.99,28.87 11.12,28.87 14.94,25.06 14.94,24.67 15.18,24.42
ADC_CHAN_2_PIN: length 14.6
  Top Layer w0.254: 7.26,29.7 7.04,29.92 7.04,31.31 ; v1(14.35,24.77) 14.35,24.03 16.25,22.13
  power w0.254: 7.16,29.67 8.4,29.67 9.87,28.2 10.59,28.2 14.2,24.59 14.4,24.79
  vias: v1(7.08,29.6)
ADC_CHAN_3_PIN: length 17.3
  Top Layer w0.254: v1(11.68,25.3) 12.35,25.3 15.77,21.87 ; 0.93,24.63 1.06,24.76 5.07,24.76 5.56,24.27 v1(6.94,24.27)
  power w0.254: 6.9,24.32 6.9,24.86 7.33,25.3 v1(11.68,25.3)
ADC_CHAN_4_PIN: length 19.7
  Top Layer w0.254: 15.29,21.64 14.93,22 14.93,22.02 14.37,22.57 13.52,22.57 ; SPD.1 2.34,14.53 v1(2.41,14.6)
  power w0.254: 13.41,22.8 13.31,22.89 8.55,22.89 2.37,16.71 2.37,14.4
  vias: v1(13.37,22.74)
BOOT0: length 17.3
  Top Layer w0.254: 24.21,4.92 24.21,5.76 ; v1(23.28,15.88) 23.08,15.68 21.28,15.68 20.56,16.4 ; 25.36,3.74 24.21,4.9
  power w0.254: 23.26,15.96 23.98,15.24 23.98,12.17 23.6,11.79 23.6,10.76 23.98,10.39 23.98,4.88
  vias: v1(23.96,4.88)
BUZZER: length 8.7
  Top Layer w0.254: 11.99,20.83 11.78,20.83 9.96,22.65 9.96,24.84 9.55,25.24 9.48,25.24 9.28,25.44 ; 14.45,20.35 13.72,21.08 12.64,21.08 12.39,20.83 12,20.83
CS: length 18.5
  Top Layer w0.254: v1(1.16,11.78) 1.16,12.81 CS.1 ; 13.07,17.82 12.7,18.18 v1(12.7,18.41)
  power w0.254: 12.72,18.51 12.85,18.64 12.85,19.5 12.35,20 11.39,20 3.19,11.8 1.15,11.8
D+: length 5.9
  Top Layer w0.254: 15.54,15.34 15.47,15.34 13.84,13.72 13.84,12.16 12.96,11.28 R3.2
D-: length 15.2
  Top Layer w0.254: 6.23,5.78 6.28,5.83 7.71,5.83 ; v1(14.87,11.75) 14.87,13.97 15.89,14.99
  pads w0.254: v1(14.87,11.75) 13.29,10.17 12.65,10.17 9.81,7.33 9.81,6.69 8.89,5.77 v1(7.68,5.77)
ICM-42688-PC_CS_PIN: length 21.5
  Top Layer w0.254: v1(22.31,19.8) 22.08,19.8 21.61,19.32 ; U3.12 11.43,10.55 v1(11.43,11.05)
  pads w0.254: 22.33,19.93 22.33,19.49 22.06,19.23 22.06,19.2 21.19,18.33 21.19,13.98 17.85,10.65 ; 17.85,10.66 17.83,10.68 17.16,10.68 15.28,12.55 14.84,12.55 ; 14.83,12.54 14.29,11.99 14.29,11.99 13.37,11.07 11.55,11.07 11.45,10.97
LED_1: length 7.4
  Top Layer w0.254: LED1.2 20.16,10.2 17.65,12.7 16.64,12.7 15.49,13.84 15.49,13.88 16.25,14.64
LED_2: length 6.4
  Top Layer w0.254: LED2.1 22.23,10.54 21.89,10.88 20.49,10.88 18.11,13.26 18.11,13.9 18.08,13.93
PININ1_PIN: length 34.3
  Top Layer w0.254: v1(3.05,20.45) 2.96,20.35 IO1.1 ; v1(22.14,20.7) 22.02,20.82 21.69,20.82 20.99,20.12 20.99,20.11
  Bottom Layer w0.254: 3.04,20.4 4.18,20.4 5.21,19.37 9.52,19.37 9.52,13.66 ; 22.26,20.74 21.51,19.99 21.51,18.56 20.53,17.59 20.53,17.58 19.89,16.93 19.89,16.9 15.32,12.34 14.63,12.34 14.16,11.86 12.32,11.86 11.78,12.41 11.18,12.41 10.64,12.95 10.24,12.95 9.53,13.66
PININ2_PIN: length 14.3
  Top Layer w0.254: 4.71,21.86 4.67,21.89 IO2.1 ; 4.73,21.84 6.29,20.28 ; 6.29,20.28 6.44,20.16 12.43,20.16 12.84,20.58 13.51,20.58 14.09,20 ; 6.29,20.28 6.31,20.26
S_SERIAL1_RX: length 11.9
  Top Layer w0.254: v1(12.46,29.67) 11.54,30.6 11.54,31.21 ; v1(18.42,23.68) 18.86,23.23 18.86,22.86 18.52,22.52
  power w0.254: 12.55,29.71 12.55,29.55 v1(18.42,23.68)
S_SERIAL1_TX: length 11.8
  Top Layer w0.254: v1(13.69,30.11) 13.02,30.77 13.02,30.92 ; 18.84,22.21 19.7,23.07 v1(19.7,23.47)
  power w0.254: v1(19.7,23.47) 19.7,24.25 13.83,30.13
S_SERIAL2_RX: length 3.9
  Top Layer w0.254: 18.79,14.64 19.36,14.07 19.36,13.66 20.04,12.97 21.1,12.97 21.59,13.46
S_SERIAL2_TX: length 4.3
  Top Layer w0.254: 18.49,14.25 18.46,14.28 18.44,14.28 ; 21.56,11.84 20.37,11.84 18.9,13.31 18.9,13.83 18.56,14.18
SCL: length 15.7
  Top Layer w0.254: v1(23.53,19.4) 23.54,19.41 23.54,20.22 ; 26.41,24.93 25.97,25.37 ; 20.91,16.76 20.91,16.75 21.5,16.16 22.36,16.16 22.81,16.61 23.2,16.61 23.36,16.77 v1(23.48,16.77) ; 25.52,25.22 25.68,25.39 SCL.1
  Bottom Layer w0.254: 23.47,16.79 23.55,16.87 23.55,19.43 ; v1(26.46,24.83) 23.62,21.99 23.62,19.47
SDA: length 17.7
  Top Layer w0.254: R7.1 27.21,27.18 27.44,27.4 ; 25.59,26.95 26.21,26.95 v1(26.45,26.71) ; U4.3 24.19,18.6 22.23,16.64 21.74,16.64 21.26,17.11 ; v1(24.74,19.36) 24.67,19.42 24.19,19.42
  Bottom Layer w0.254: 26.48,26.77 26.48,25.64 27.04,25.07 27.04,22.44 25.96,21.36 25.96,20.57 v1(24.74,19.36)
SERIAL_1: length 23.9
  Top Layer w0.254: 19.99,15.53 20.04,15.53 20.91,14.66 v1(22.06,14.66) ; 15.05,31.28 v1(17.71,28.62) ; 14.91,31.69 15.18,31.69
  Bottom Layer w0.254: 22.02,14.67 22.64,15.29 22.64,16.76 22.9,17.02 22.9,20.77 22.8,20.87 22.8,22.15 20.25,24.7 20.25,27.69 19.29,28.65 17.68,28.65
SERIAL_2: length 22.1
  Top Layer w0.254: 19.95,31.69 20.85,31.69 20.88,31.66 ; 20.45,15.89 21.04,15.3 22.63,15.3 v1(23.08,14.85)
  pads w0.254: 19.91,31.56 22.9,28.57 22.9,17.02 22.64,16.76 22.64,15.27 23,14.92
  vias: v1(19.95,31.51)
SERIAL_3: length 21.4
  Top Layer w0.254: v1(28.32,22.86) 28.7,23.24 29.7,23.24 S3.1 ; 15.15,21.06 14.06,22.15 12.61,22.15 12.54,22.08
  power w0.254: 12.64,22.12 17.15,22.12 17.66,22.62 20.79,22.62 21.29,22.12 27.62,22.12 28.32,22.81
  vias: v1(12.63,22.24)
SERIAL_4: length 19.7
  Top Layer w0.254: 14.8,20.7 13.87,21.64 12.35,21.64 ; S4.1 3.63,12.71 v1(3.63,14.05)
  power w0.254: 12.21,21.52 4.73,14.05 v1(3.63,14.05)
  vias: v1(12.17,21.59)
SERIAL_5: length 24.1
  Top Layer w0.254: v1(4.78,2.47) 5.71,1.54 5.71,1.46 ; v1(20.06,13.93) 19.5,14.49 19.5,14.65 19.15,14.99 19.14,14.99
  Bottom Layer w0.254: 20.06,13.9 20.06,13.45 15.06,8.45 15.06,6.71 12.26,3.91 6.23,3.91 v1(4.78,2.47)
SERIAL_6: length 12.8
  Top Layer w0.254: v1(23.03,13.77) 22.38,13.77 22.13,14.02 20.79,14.02 19.5,15.32 19.5,15.34 ; S6.1 29.92,17.27 v1(28.58,17.27)
  Bottom Layer w0.254: 28.64,17.35 25.03,13.75 22.97,13.75
SPI2_MISO: length 27.5
  Top Layer w0.254: 0.83,18.81 5,18.81 6.17,17.64 10.26,17.64 ; 10.26,17.68 10.27,17.69 10.76,17.69 10.77,17.7 11,17.7 11.95,16.75 13.43,16.75 13.77,17.1 13.77,17.11 ; 2.98,19.41 2.98,18.88 ; v1(8.28,10.55) 8.28,10.04 8.81,9.5
  pads w0.254: 8.32,10.53 2.22,16.63 2.22,18.61 v1(2.98,19.38)
SPI2_MOSI: length 24.7
  Top Layer w0.254: 9.68,9.82 9.68,10.37 v1(9.14,10.91) ; 3.92,17.34 v1(4.56,17.98) ; 3.92,17.34 5.97,17.34 6.03,17.28 10.1,17.28 10.51,16.88 11.05,16.88 11.68,16.28 13.66,16.28 13.9,16.52 ; 3.92,17.34 MOSI.1
  pads w0.254: 9.14,10.94 9.14,12.46 4.59,17.01 4.59,18.03
SPI2_SCK: length 25.6
  Top Layer w0.254: 0.99,15.89 0.81,16.06 ; 0.99,15.89 7,15.92 10.16,12.77 ; 0.99,15.89 0.99,15.89 ; 10.16,10.79 U3.13 ; 10.16,10.79 v1(10.54,11.18) ; 10.16,10.79 10.16,12.77 ; v1(11.04,18.59) 11.04,18.45 12.35,17.14 12.98,17.14 13.3,17.47 13.42,17.47
  power w0.254: v1(11.04,18.59) 11.04,17.59 9.99,16.54 9.99,11.7 10.6,11.09
UART1_RX_PIN: length 22.5
  Top Layer w0.254: 15.19,15.7 15.15,15.7 13.04,13.59 11.3,13.59 v1(11.25,13.63)
  Bottom Layer w0.254: v1(11.25,13.63) 10.27,14.61 10.27,18.65 11.12,19.5 12.05,19.5 12.55,19 13.31,19 17.84,23.53 17.84,23.92 18.34,24.42 18.34,25.61
UART1_TX_PIN: length 19.4
  Top Layer w0.254: v1(11.24,14.65) 13.44,14.65 14.83,16.05
  Bottom Layer w0.254: 19.6,25.79 19.6,24.79 19.01,24.19 19.01,23.43 18.66,23.09 17.91,23.09 13.28,18.47 13.28,18.17 12.94,17.83 12.65,17.83 11.24,16.43 v1(11.24,14.65)
UART2_RX_PIN: length 24.5
  Top Layer w0.254: v1(16.13,24.13) 16.13,23.66 16.95,22.84 ; v1(10.94,29.63) 10.03,30.53 10.03,31.18
  power w0.254: v1(10.94,29.63) 11.51,29.63 16.17,24.97 16.17,24.21
  Bottom Layer w0.254: v1(10.94,29.63) 9.96,29.63 8.83,28.5 8.83,25.93 7.75,24.85 7.75,20.74 6.89,19.88 5.89,19.88
UART2_TX_PIN: length 28.2
  Top Layer w0.254: v1(16.93,23.77) 17.16,23.77 18.07,22.86 ; 5.63,31.49 v1(5.63,29.83)
  power w0.254: 5.68,29.86 5.68,26.65 4.45,25.42 v1(4.45,21.14) ; 4.44,21.08 4.58,21.08 7.39,23.89 14.22,23.89 14.57,23.55 16.7,23.55 v1(16.93,23.77)
  Bottom Layer w0.254: 6.19,21.14 4.27,21.14
WS2811_PIN: length 4.5
  Top Layer w0.254: 10.54,16.26 11.14,15.66 13.73,15.66 14.48,16.4
ZER-: length 5.8
  Top Layer w0.254: ZER-.1 4.86,23.37 Q1.3
$1N2914: length 4.6
  Top Layer w0.254: 13.74,19.64 13.31,20.08 13.05,20.08 12.64,19.67 12.45,19.67 ; 12.45,19.67 12.43,19.67 ; 12.45,19.67 10.93,19.66 9.95,18.68
$1N3163: length 4.6
  Top Layer w0.254: 21.18,23.46 21.21,23.44 21.21,21.7 20.39,20.89 ; 21.18,23.46 20.28,24.37 20.28,24.79 ; 21.18,23.46 21.16,23.46
$1N3172: length 5.3
  Top Layer w0.254: 22.81,25 22.71,24.9 22.71,24.02 21.97,23.27 21.97,21.79 ; 20.69,20.52 20.71,20.52 21.94,21.76
$1N3229: length 9.3
  Top Layer w0.254: v1(20.55,22.04) 20.55,21.71 19.95,21.11 ; v1(24.91,18.18) 24.6,17.87 24.6,17.21
  power w0.254: 20.72,22.1 20.37,21.74 20.37,20.8 22.12,19.04 22.89,19.04 23.7,18.23 24.92,18.23
$1N5682: length 17.8
  Top Layer w0.254: v1(3.75,5.45) 4.08,5.79 4.68,5.79 ; 14.92,5.7 15.18,5.95 15.18,6.49 15.11,6.55 ; 14.92,5.7 15.38,5.7 v1(15.62,5.46) ; 14.92,5.7 14.34,5.7 14.18,5.86 14.18,6.48 14.11,6.55
  power w0.254: 15.56,5.5 13.66,3.6 5.54,3.6 3.7,5.44
$1N5704: length 6.5
  Top Layer w0.254: 15.61,6.55 15.61,7.63 15.37,7.87 ; 15.37,7.87 14.86,7.87 14.61,7.62 14.61,6.56 14.61,6.55 ; 15.37,7.87 15.37,9.78 14.61,10.54 R3.1
$1N5719: length 17.7
  Top Layer w0.254: 4.76,7.34 3.9,7.34 v1(3.77,7.21) ; 16.61,6.55 16.61,7.52 v1(16.26,7.87)
  power w0.254: 16.22,7.93 12.93,4.65 10.27,4.65 10.23,4.68 5.9,4.68 3.87,6.71 3.87,7.29
$1N5723: length 2.6
  Top Layer w0.254: R5.1 14.47,8.63 13.65,7.81 13.65,6.59 13.61,6.55
$1N8041: length 2
  Top Layer w0.254: 27.87,9.83 26.87,9.83 26.17,10.53
$1N9067: length 6.5
  Top Layer w0.254: 7.77,25.43 7.66,25.32 7.66,21.88 8.5,21.03 8.5,21 ; 7.76,27.15 7.76,25.43
$1N10019: length 5.6
  Top Layer w0.254: LED2.2 22.23,8.25 21.59,7.62 19.17,7.62 R12.1
$1N15873: length 2.7
  Top Layer w0.254: LED3.2 24.6,13.3 26.15,14.85 R13.2
$1N16015: length 4.2
  Top Layer w0.254: LED1.1 20.18,8.46 19.48,8.46 19.3,8.64 19.3,9.65 18.54,10.41 18.15,10.41 R11.1

## Copper pours and planes (outline as drawn; the poured copper is in the pictures)
GND on Top Layer: -0.07,32.54 31.79,32.54 31.79,-0.01 -0.07,-0.01
GND on Bottom Layer: 0.04,32.5 31.73,32.5 31.73,0.01 0.04,0.01
